# EAGLE schematic charlie_array_v1 (EAGLE 6.4)
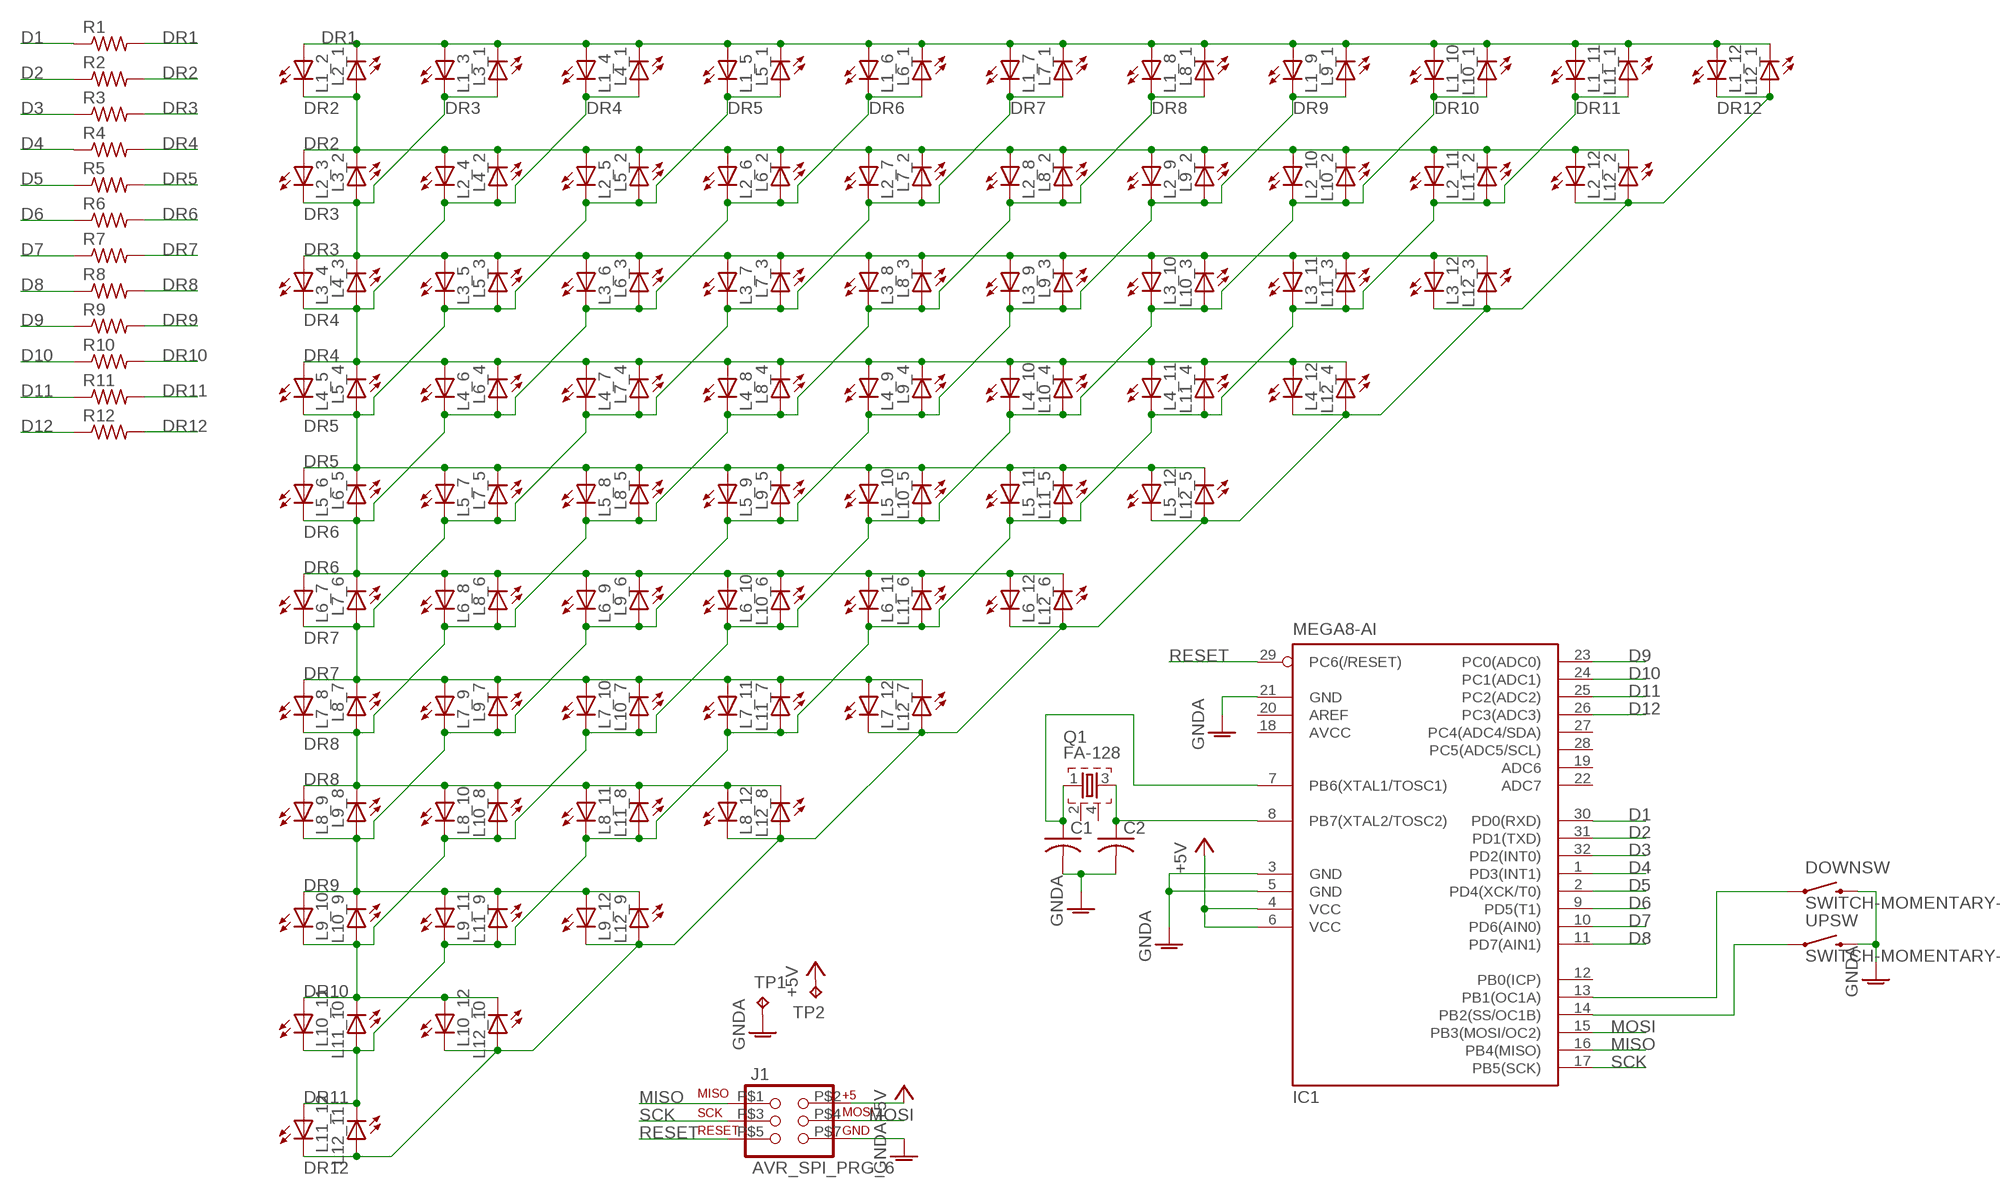
[diagram p0: schematic, sheet 1]

## Parts
C1  C-USC0603  [C0603]
C2  C-USC0603  [C0603]
DOWNSW  SWITCH-MOMENTARY-2  [TACTILE_SWITCH_TALL]
IC1  MEGA8-AI  [TQFP32-08]
J1  AVR_SPI_PRG_6  [2X3_ICSP_SMD]
L1_2  LEDCHIPLED_0603  [CHIPLED_0603]
L1_3  LEDCHIPLED_0603  [CHIPLED_0603]
L1_4  LEDCHIPLED_0603  [CHIPLED_0603]
L1_5  LEDCHIPLED_0603  [CHIPLED_0603]
L1_6  LEDCHIPLED_0603  [CHIPLED_0603]
L1_7  LEDCHIPLED_0603  [CHIPLED_0603]
L1_8  LEDCHIPLED_0603  [CHIPLED_0603]
L1_9  LEDCHIPLED_0603  [CHIPLED_0603]
L1_10  LEDCHIPLED_0603  [CHIPLED_0603]
L1_11  LEDCHIPLED_0603  [CHIPLED_0603]
L1_12  LEDCHIPLED_0603  [CHIPLED_0603]
L2_1  LEDCHIPLED_0603  [CHIPLED_0603]
L2_3  LEDCHIPLED_0603  [CHIPLED_0603]
L2_4  LEDCHIPLED_0603  [CHIPLED_0603]
L2_5  LEDCHIPLED_0603  [CHIPLED_0603]
L2_6  LEDCHIPLED_0603  [CHIPLED_0603]
L2_7  LEDCHIPLED_0603  [CHIPLED_0603]
L2_8  LEDCHIPLED_0603  [CHIPLED_0603]
L2_9  LEDCHIPLED_0603  [CHIPLED_0603]
L2_10  LEDCHIPLED_0603  [CHIPLED_0603]
L2_11  LEDCHIPLED_0603  [CHIPLED_0603]
L2_12  LEDCHIPLED_0603  [CHIPLED_0603]
L3_1  LEDCHIPLED_0603  [CHIPLED_0603]
L3_2  LEDCHIPLED_0603  [CHIPLED_0603]
L3_4  LEDCHIPLED_0603  [CHIPLED_0603]
L3_5  LEDCHIPLED_0603  [CHIPLED_0603]
L3_6  LEDCHIPLED_0603  [CHIPLED_0603]
L3_7  LEDCHIPLED_0603  [CHIPLED_0603]
L3_8  LEDCHIPLED_0603  [CHIPLED_0603]
L3_9  LEDCHIPLED_0603  [CHIPLED_0603]
L3_10  LEDCHIPLED_0603  [CHIPLED_0603]
L3_11  LEDCHIPLED_0603  [CHIPLED_0603]
L3_12  LEDCHIPLED_0603  [CHIPLED_0603]
L4_1  LEDCHIPLED_0603  [CHIPLED_0603]
L4_2  LEDCHIPLED_0603  [CHIPLED_0603]
L4_3  LEDCHIPLED_0603  [CHIPLED_0603]
L4_5  LEDCHIPLED_0603  [CHIPLED_0603]
L4_6  LEDCHIPLED_0603  [CHIPLED_0603]
L4_7  LEDCHIPLED_0603  [CHIPLED_0603]
L4_8  LEDCHIPLED_0603  [CHIPLED_0603]
L4_9  LEDCHIPLED_0603  [CHIPLED_0603]
L4_10  LEDCHIPLED_0603  [CHIPLED_0603]
L4_11  LEDCHIPLED_0603  [CHIPLED_0603]
L4_12  LEDCHIPLED_0603  [CHIPLED_0603]
L5_1  LEDCHIPLED_0603  [CHIPLED_0603]
L5_2  LEDCHIPLED_0603  [CHIPLED_0603]
L5_3  LEDCHIPLED_0603  [CHIPLED_0603]
L5_4  LEDCHIPLED_0603  [CHIPLED_0603]
L5_6  LEDCHIPLED_0603  [CHIPLED_0603]
L5_7  LEDCHIPLED_0603  [CHIPLED_0603]
L5_8  LEDCHIPLED_0603  [CHIPLED_0603]
L5_9  LEDCHIPLED_0603  [CHIPLED_0603]
L5_10  LEDCHIPLED_0603  [CHIPLED_0603]
L5_11  LEDCHIPLED_0603  [CHIPLED_0603]
L5_12  LEDCHIPLED_0603  [CHIPLED_0603]
L6_1  LEDCHIPLED_0603  [CHIPLED_0603]
L6_2  LEDCHIPLED_0603  [CHIPLED_0603]
L6_3  LEDCHIPLED_0603  [CHIPLED_0603]
L6_4  LEDCHIPLED_0603  [CHIPLED_0603]
L6_5  LEDCHIPLED_0603  [CHIPLED_0603]
L6_7  LEDCHIPLED_0603  [CHIPLED_0603]
L6_8  LEDCHIPLED_0603  [CHIPLED_0603]
L6_9  LEDCHIPLED_0603  [CHIPLED_0603]
L6_10  LEDCHIPLED_0603  [CHIPLED_0603]
L6_11  LEDCHIPLED_0603  [CHIPLED_0603]
L6_12  LEDCHIPLED_0603  [CHIPLED_0603]
L7_1  LEDCHIPLED_0603  [CHIPLED_0603]
L7_2  LEDCHIPLED_0603  [CHIPLED_0603]
L7_3  LEDCHIPLED_0603  [CHIPLED_0603]
L7_4  LEDCHIPLED_0603  [CHIPLED_0603]
L7_5  LEDCHIPLED_0603  [CHIPLED_0603]
L7_6  LEDCHIPLED_0603  [CHIPLED_0603]
L7_8  LEDCHIPLED_0603  [CHIPLED_0603]
L7_9  LEDCHIPLED_0603  [CHIPLED_0603]
L7_10  LEDCHIPLED_0603  [CHIPLED_0603]
L7_11  LEDCHIPLED_0603  [CHIPLED_0603]
L7_12  LEDCHIPLED_0603  [CHIPLED_0603]
L8_1  LEDCHIPLED_0603  [CHIPLED_0603]
L8_2  LEDCHIPLED_0603  [CHIPLED_0603]
L8_3  LEDCHIPLED_0603  [CHIPLED_0603]
L8_4  LEDCHIPLED_0603  [CHIPLED_0603]
L8_5  LEDCHIPLED_0603  [CHIPLED_0603]
L8_6  LEDCHIPLED_0603  [CHIPLED_0603]
L8_7  LEDCHIPLED_0603  [CHIPLED_0603]
L8_9  LEDCHIPLED_0603  [CHIPLED_0603]
L8_10  LEDCHIPLED_0603  [CHIPLED_0603]
L8_11  LEDCHIPLED_0603  [CHIPLED_0603]
L8_12  LEDCHIPLED_0603  [CHIPLED_0603]
L9_1  LEDCHIPLED_0603  [CHIPLED_0603]
L9_2  LEDCHIPLED_0603  [CHIPLED_0603]
L9_3  LEDCHIPLED_0603  [CHIPLED_0603]
L9_4  LEDCHIPLED_0603  [CHIPLED_0603]
L9_5  LEDCHIPLED_0603  [CHIPLED_0603]
L9_6  LEDCHIPLED_0603  [CHIPLED_0603]
L9_7  LEDCHIPLED_0603  [CHIPLED_0603]
L9_8  LEDCHIPLED_0603  [CHIPLED_0603]
L9_10  LEDCHIPLED_0603  [CHIPLED_0603]
L9_11  LEDCHIPLED_0603  [CHIPLED_0603]
L9_12  LEDCHIPLED_0603  [CHIPLED_0603]
L10_1  LEDCHIPLED_0603  [CHIPLED_0603]
L10_2  LEDCHIPLED_0603  [CHIPLED_0603]
L10_3  LEDCHIPLED_0603  [CHIPLED_0603]
L10_4  LEDCHIPLED_0603  [CHIPLED_0603]
L10_5  LEDCHIPLED_0603  [CHIPLED_0603]
L10_6  LEDCHIPLED_0603  [CHIPLED_0603]
L10_7  LEDCHIPLED_0603  [CHIPLED_0603]
L10_8  LEDCHIPLED_0603  [CHIPLED_0603]
L10_9  LEDCHIPLED_0603  [CHIPLED_0603]
L10_11  LEDCHIPLED_0603  [CHIPLED_0603]
L10_12  LEDCHIPLED_0603  [CHIPLED_0603]
L11_1  LEDCHIPLED_0603  [CHIPLED_0603]
L11_2  LEDCHIPLED_0603  [CHIPLED_0603]
L11_3  LEDCHIPLED_0603  [CHIPLED_0603]
L11_4  LEDCHIPLED_0603  [CHIPLED_0603]
L11_5  LEDCHIPLED_0603  [CHIPLED_0603]
L11_6  LEDCHIPLED_0603  [CHIPLED_0603]
L11_7  LEDCHIPLED_0603  [CHIPLED_0603]
L11_8  LEDCHIPLED_0603  [CHIPLED_0603]
L11_9  LEDCHIPLED_0603  [CHIPLED_0603]
L11_10  LEDCHIPLED_0603  [CHIPLED_0603]
L11_12  LEDCHIPLED_0603  [CHIPLED_0603]
L12_1  LEDCHIPLED_0603  [CHIPLED_0603]
L12_2  LEDCHIPLED_0603  [CHIPLED_0603]
L12_3  LEDCHIPLED_0603  [CHIPLED_0603]
L12_4  LEDCHIPLED_0603  [CHIPLED_0603]
L12_5  LEDCHIPLED_0603  [CHIPLED_0603]
L12_6  LEDCHIPLED_0603  [CHIPLED_0603]
L12_7  LEDCHIPLED_0603  [CHIPLED_0603]
L12_8  LEDCHIPLED_0603  [CHIPLED_0603]
L12_9  LEDCHIPLED_0603  [CHIPLED_0603]
L12_10  LEDCHIPLED_0603  [CHIPLED_0603]
L12_11  LEDCHIPLED_0603  [CHIPLED_0603]
Q1  FA-128  [FA-128]
R1  R-US_R0603  [R0603]
R2  R-US_R0603  [R0603]
R3  R-US_R0603  [R0603]
R4  R-US_R0603  [R0603]
R5  R-US_R0603  [R0603]
R6  R-US_R0603  [R0603]
R7  R-US_R0603  [R0603]
R8  R-US_R0603  [R0603]
R9  R-US_R0603  [R0603]
R10  R-US_R0603  [R0603]
R11  R-US_R0603  [R0603]
R12  R-US_R0603  [R0603]
TP1  TPTP20SQ  [TP20SQ]
TP2  TPTP20SQ  [TP20SQ]
UPSW  SWITCH-MOMENTARY-2  [TACTILE_SWITCH_TALL]

## Nets
+5V: IC1.4(VCC) IC1.6(VCC) J1.P$2 TP2.TP
D1: IC1.30(PD0(RXD)) R1.1
D2: IC1.31(PD1(TXD)) R2.1
D3: IC1.32(PD2(INT0)) R3.1
D4: IC1.1(PD3(INT1)) R4.1
D5: IC1.2(PD4(XCK/T0)) R5.1
D6: IC1.9(PD5(T1)) R6.1
D7: IC1.10(PD6(AIN0)) R7.1
D8: IC1.11(PD7(AIN1)) R8.1
D9: IC1.23(PC0(ADC0)) R9.1
D10: IC1.24(PC1(ADC1)) R10.1
D11: IC1.25(PC2(ADC2)) R11.1
D12: IC1.26(PC3(ADC3)) R12.1
DR1: L1_2.A L1_3.A L1_4.A L1_5.A L1_6.A L1_7.A L1_8.A L1_9.A L1_10.A L1_11.A L1_12.A L2_1.C L3_1.C L4_1.C L5_1.C L6_1.C L7_1.C L8_1.C L9_1.C L10_1.C L11_1.C L12_1.C R1.2
DR2: L1_2.C L2_1.A L2_3.A L2_4.A L2_5.A L2_6.A L2_7.A L2_8.A L2_9.A L2_10.A L2_11.A L2_12.A L3_2.C L4_2.C L5_2.C L6_2.C L7_2.C L8_2.C L9_2.C L10_2.C L11_2.C L12_2.C R2.2
DR3: L1_3.C L2_3.C L3_1.A L3_2.A L3_4.A L3_5.A L3_6.A L3_7.A L3_8.A L3_9.A L3_10.A L3_11.A L3_12.A L4_3.C L5_3.C L6_3.C L7_3.C L8_3.C L9_3.C L10_3.C L11_3.C L12_3.C R3.2
DR4: L1_4.C L2_4.C L3_4.C L4_1.A L4_2.A L4_3.A L4_5.A L4_6.A L4_7.A L4_8.A L4_9.A L4_10.A L4_11.A L4_12.A L5_4.C L6_4.C L7_4.C L8_4.C L9_4.C L10_4.C L11_4.C L12_4.C R4.2
DR5: L1_5.C L2_5.C L3_5.C L4_5.C L5_1.A L5_2.A L5_3.A L5_4.A L5_6.A L5_7.A L5_8.A L5_9.A L5_10.A L5_11.A L5_12.A L6_5.C L7_5.C L8_5.C L9_5.C L10_5.C L11_5.C L12_5.C R5.2
DR6: L1_6.C L2_6.C L3_6.C L4_6.C L5_6.C L6_1.A L6_2.A L6_3.A L6_4.A L6_5.A L6_7.A L6_8.A L6_9.A L6_10.A L6_11.A L6_12.A L7_6.C L8_6.C L9_6.C L10_6.C L11_6.C L12_6.C R6.2
DR7: L1_7.C L2_7.C L3_7.C L4_7.C L5_7.C L6_7.C L7_1.A L7_2.A L7_3.A L7_4.A L7_5.A L7_6.A L7_8.A L7_9.A L7_10.A L7_11.A L7_12.A L8_7.C L9_7.C L10_7.C L11_7.C L12_7.C R7.2
DR8: L1_8.C L2_8.C L3_8.C L4_8.C L5_8.C L6_8.C L7_8.C L8_1.A L8_2.A L8_3.A L8_4.A L8_5.A L8_6.A L8_7.A L8_9.A L8_10.A L8_11.A L8_12.A L9_8.C L10_8.C L11_8.C L12_8.C R8.2
DR9: L1_9.C L2_9.C L3_9.C L4_9.C L5_9.C L6_9.C L7_9.C L8_9.C L9_1.A L9_2.A L9_3.A L9_4.A L9_5.A L9_6.A L9_7.A L9_8.A L9_10.A L9_11.A L9_12.A L10_9.C L11_9.C L12_9.C R9.2
DR10: L1_10.C L2_10.C L3_10.C L4_10.C L5_10.C L6_10.C L7_10.C L8_10.C L9_10.C L10_1.A L10_2.A L10_3.A L10_4.A L10_5.A L10_6.A L10_7.A L10_8.A L10_9.A L10_11.A L10_12.A L11_10.C L12_10.C R10.2
DR11: L1_11.C L2_11.C L3_11.C L4_11.C L5_11.C L6_11.C L7_11.C L8_11.C L9_11.C L10_11.C L11_1.A L11_2.A L11_3.A L11_4.A L11_5.A L11_6.A L11_7.A L11_8.A L11_9.A L11_10.A L11_12.A L12_11.C R11.2
DR12: L1_12.C L2_12.C L3_12.C L4_12.C L5_12.C L6_12.C L7_12.C L8_12.C L9_12.C L10_12.C L11_12.C L12_1.A L12_2.A L12_3.A L12_4.A L12_5.A L12_6.A L12_7.A L12_8.A L12_9.A L12_10.A L12_11.A R12.2
GNDA: C1.2 C2.2 DOWNSW.B2 IC1.3(GND) IC1.5(GND) IC1.21(GND) J1.P$7 TP1.TP UPSW.B2
MISO: IC1.16(PB4(MISO)) J1.P$1
MOSI: IC1.15(PB3(MOSI/OC2)) J1.P$4
N$1: C2.1 IC1.8(PB7(XTAL2/TOSC2)) Q1.3
N$2: IC1.14(PB2(SS/OC1B)) UPSW.A2
N$3: DOWNSW.A2 IC1.13(PB1(OC1A))
N$4: C1.1 IC1.7(PB6(XTAL1/TOSC1)) Q1.1
RESET: IC1.29(PC6(/RESET)) J1.P$5
SCK: IC1.17(PB5(SCK)) J1.P$3
Unconnected: IC1.12(PB0(ICP)) IC1.19(ADC6) IC1.20(AREF) IC1.22(ADC7) IC1.27(PC4(ADC4/SDA)) IC1.28(PC5(ADC5/SCL)) Q1.2 Q1.4

## Power pins joined to a net without a drawn wire
AVCC: IC1.18(AVCC)

## Library data of the parts
C1 C2 = rcl:C-US: CAPACITOR, American symbol
DOWNSW UPSW = SparkFun:SWITCH-MOMENTARY-2
IC1 = atmel:MEGA8: MICROCONTROLLER 8 Kbytes FLASH, 1 kbytes SRAM, 512 bytes EEPROM, USART, 6-channel 10 bit ADC, 2-channel 8 bit ADC Pin compatible with Atmega48, ATMega88, ATMega168 Source: avr.lbr; MPN: ATMEGA8-16AU; OC_FARNELL: 9171371; OC_NEWARK: 73M8863
J1 = SparkFun:AVR_SPI_PRG_6: AVR ISP 6 Pin This is the reduced ISP connector for AVR programming. Common on Arduino. This footprint will take up less PCB space and can be used with a 10-pin to 6-pin adapter such as SKU: BOB-08508
L1_2-L1_12 L2_1 L2_3-L2_12 L3_1 L3_2 L3_4-L3_12 L4_1-L4_3 L4_5-L4_12 L5_1-L5_4 L5_6-L5_12 L6_1-L6_5 L6_7-L6_12 L7_1-L7_6 L7_8-L7_12 L8_1-L8_7 L8_9-L8_12 L9_1-L9_8 L9_10-L9_12 L10_1-L10_9 L10_11 L10_12 L11_1-L11_10 L11_12 L12_1-L12_11 = led:LED: LED OSRAM: - CHIPLED LG R971, LG N971, LY N971, LG Q971, LY Q971, LO R971, LY R971 LH N974, LH R974 LS Q976, LO Q976, LY Q976 LO Q996 - Hyper CHIPLED LW Q18S LB Q993, LB Q99A, LB R99A - SideLED LS A670, LO A670, LY A670, LG A670, LP A670 LB A673, LV A673, LT A673, LW A673 LH A674 LY A675 LS A676, LA A676, LO A676, LY A676, LW A676 LS A679, LY A679, LG A679 - Hyper Micro SIDELED® LS Y876, LA Y876, LO Y876, LY Y876 LT Y87S - SmartLED LW L88C, LW L88S LB L89C, LB L89S, LG L890 LS L89K, LO L89K, LY L89K LS L896, LA L896, LO L896, LY L896 - TOPLED LS T670, LO T670, LY T670, LG T670, LP T670 LSG T670, LSP T670, LSY T670, LOP T670, LYG T670 LG T671, LOG T671, LSG T671 LB T673, LV T673, LT T673, LW T673 LH T674 LS T676, LA T676, LO T676, LY T676, LB T676, LH T676, LSB T676, LW T676 LB T67C, LV T67C, LT T67C, LS T67K, LO T67K, LY T67K, LW E67C LS E67B, LA E67B, LO E67B, LY E67B, LB E67C, LV E67C, LT E67C LW T67C LS T679, LY T679, LG T679 LS T770, LO T770, LY T770, LG T770, LP T770 LB T773, LV T773, LT T773, LW T773 LH T774 LS E675, LA E675, LY E675, LS T675 LS T776, LA T776, LO T776, LY T776, LB T776 LHGB T686 LT T68C, LB T68C - Hyper Mini TOPLED® LB M676 - Mini TOPLED Santana® LG M470 LS M47K, LO M47K, LY M47K Source: http://www.osram.convergy.de LUXEON: - LUMILED® LXK2-PW12-R00, LXK2-PW12-S00, LXK2-PW14-U00, LXK2-PW14-V00 LXK2-PM12-R00, LXK2-PM12-S00, LXK2-PM14-U00 LXK2-PE12-Q00, LXK2-PE12-R00, LXK2-PE12-S00, LXK2-PE14-T00, LXK2-PE14-U00 LXK2-PB12-K00, LXK2-PB12-L00, LXK2-PB12-M00, LXK2-PB14-N00, LXK2-PB14-P00, LXK2-PB14-Q00 LXK2-PR12-L00, LXK2-PR12-M00, LXK2-PR14-Q00, LXK2-PR14-R00 LXK2-PD12-Q00, LXK2-PD12-R00, LXK2-PD12-S00 LXK2-PH12-R00, LXK2-PH12-S00 LXK2-PL12-P00, LXK2-PL12-Q00, LXK2-PL12-R00 Source: www.luxeon.com KINGBRIGHT: KA-3528ASYC Source: www.kingbright.com
Q1 = crystal:FA-: MHz RANGE CRYSTAL UNIT Source: Epson Toyocom
R1-R12 = rcl:R-US_: RESISTOR, American symbol
TP1 TP2 = testpad:TP: Test pad